# Altium schematic sheet Pressure_Transducers.SchDoc
size Letter; Organization: Altium Limited; Address1: L3, 12a Rodborough Rd; Address2: Frenchs Forest; Address3: NSW; Address4: Australia 2086
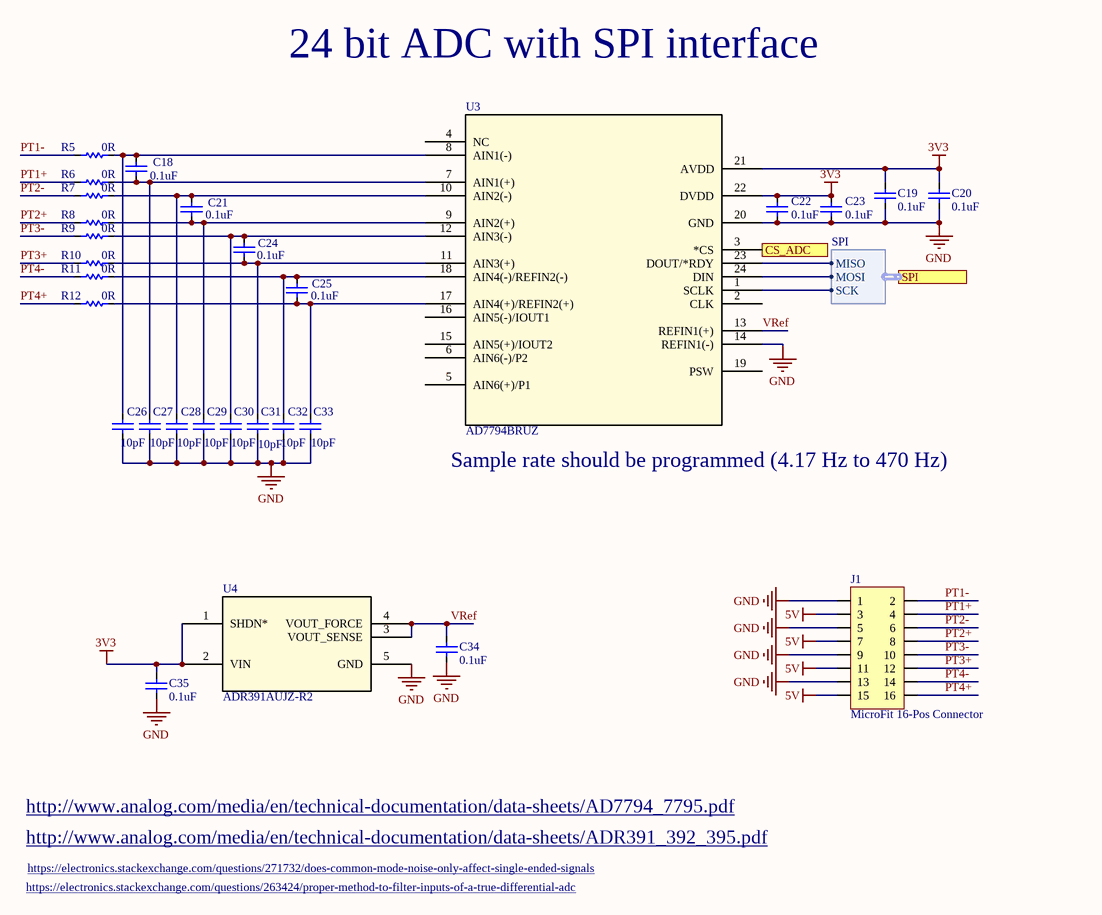
[diagram p0: Pressure_Transducers.SchDoc]

## Parts
C18  value 0.1uF  [0603]  (hidden comment: Cap)
C19  value 0.1uF  [0603]  (hidden comment: Cap)
C20  value 0.1uF  [0603]  (hidden comment: Cap)
C21  value 0.1uF  [0603]  (hidden comment: Cap)
C22  value 0.1uF  [0603]  (hidden comment: Cap)
C23  value 0.1uF  [0603]  (hidden comment: Cap)
C24  value 0.1uF  [0603]  (hidden comment: Cap)
C25  value 0.1uF  [0603]  (hidden comment: Cap)
C26  value 10pF  [0603]  (hidden comment: Cap)
C27  value 10pF  [0603]  (hidden comment: Cap)
C28  value 10pF  [0603]  (hidden comment: Cap)
C29  value 10pF  [0603]  (hidden comment: Cap)
C30  value 10pF  [0603]  (hidden comment: Cap)
C31  value 10pF  [0603]  (hidden comment: Cap)
C32  value 10pF  [0603]  (hidden comment: Cap)
C33  value 10pF  [0603]  (hidden comment: Cap)
C34  value 0.1uF  [0603]  (hidden comment: Cap)
C35  value 0.1uF  [0603]  (hidden comment: Cap)
J1  MicroFit 16-Pos Connector  [Microfit-16Pos]
R5  value 0R  [SB-2pos]  (hidden comment: Res)
R6  value 0R  [SB-2pos]  (hidden comment: Res)
R7  value 0R  [SB-2pos]  (hidden comment: Res)
R8  value 0R  [SB-2pos]  (hidden comment: Res)
R9  value 0R  [SB-2pos]  (hidden comment: Res)
R10  value 0R  [SB-2pos]  (hidden comment: Res)
R11  value 0R  [SB-2pos]  (hidden comment: Res)
R12  value 0R  [SB-2pos]  (hidden comment: Res)
U3  AD7794BRUZ  [RU_24]
U4  ADR391AUJZ-R2  [UJ_5]

## Ports
CS_ADC (in), SPI (harness SPI)

## Harnesses
SPI: MISO, MOSI, SCK

## Nets
3V3: C19.2 C20.2 C22.2 C23.2 C35.2 U3.21(AVDD) U3.22(DVDD) U4.1(SHDN*) U4.2(VIN)
5V: J1.3 J1.7 J1.11 J1.15
GND: C19.1 C20.1 C22.1 C23.1 C26.1 C27.1 C28.1 C29.1 C30.1 C31.1 C32.1 C33.1 C34.1 C35.1 J1.1 J1.5 J1.9 J1.13 U3.14(REFIN1(-)) U3.20(GND) U4.5(GND)
CS_ADC: U3.3(*CS) ; port CS_ADC
PT1+: J1.4 R6.1
PT1-: J1.2 R5.1
PT2+: J1.8 R8.1
PT2-: J1.6 R7.1
PT3+: J1.12 R10.1
PT3-: J1.10 R9.1
PT4+: J1.16 R12.1
PT4-: J1.14 R11.1
VRef: C34.2 U3.13(REFIN1(+)) U4.3(VOUT_SENSE) U4.4(VOUT_FORCE)
NetC18_1: C18.1 C27.2 R6.2 U3.7(AIN1(+))
NetC18_2: C18.2 C26.2 R5.2 U3.8(AIN1(-))
NetC21_1: C21.1 C29.2 R8.2 U3.9(AIN2(+))
NetC21_2: C21.2 C28.2 R7.2 U3.10(AIN2(-))
NetC24_1: C24.1 C31.2 R10.2 U3.11(AIN3(+))
NetC24_2: C24.2 C30.2 R9.2 U3.12(AIN3(-))
NetC25_1: C25.1 C33.2 R12.2 U3.17(AIN4(+)/REFIN2(+))
NetC25_2: C25.2 C32.2 R11.2 U3.18(AIN4(-)/REFIN2(-))
NetU3_1: U3.1(SCLK) ; port SPI.SCK
NetU3_23: U3.23(DOUT/*RDY) ; port SPI.MISO
NetU3_24: U3.24(DIN) ; port SPI.MOSI

Not connected (* = marked no-connect by the designer): U3 2(CLK) 4(NC) 5(AIN6(+)/P1) 6(AIN6(-)/P2) 15(AIN5(+)/IOUT2) 16(AIN5(-)/IOUT1) 19(PSW)

## Notes on the sheet
- 24 bit ADC with SPI interface
- Sample rate should be programmed (4.17 Hz to 470 Hz)
- http://www.analog.com/media/en/technical-documentation/data-sheets/AD7794_7795.pdf
- http://www.analog.com/media/en/technical-documentation/data-sheets/ADR391_392_395.pdf
- https://electronics.stackexchange.com/questions/263424/proper-method-to-filter-inputs-of-a-true-differential-adc
- https://electronics.stackexchange.com/questions/271732/does-common-mode-noise-only-affect-single-ended-signals
- Title
- Size:
- Date:
- Letter
- Number:
- Time:
- Revision:
- Sheet
- of
- File:

## Library data of the parts
J1 = Micro-Fit 16Pos: Molex MicroFit 16-Pos Connector; URL: https://www.digikey.com/product-detail/en/molex-llc/0430451628/WM10719-ND/3310256; DigiKey PN: WM10719-ND
U3 = AD7794BRUZ: Imported; Value: Value; Type: Type; RefDes: RefDes
U4 = ADR391AUJZ-R2: Imported; Manufacturer_Part_Number: ADR391AUJZ-R2; Vendor: Vendor; Value: Value; Type: Type; RefDes: Refdes